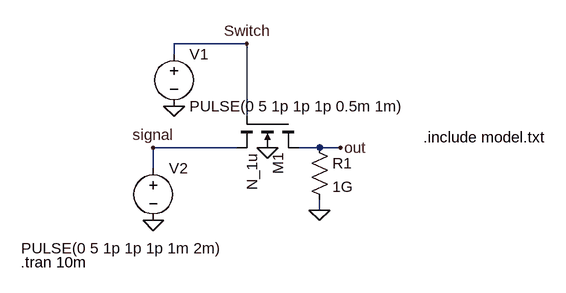
[diagram p0: schematic nmos_test_large_res.asc]
nmos_test_large_res.asc, the LTspice schematic file:
Version 4
SHEET 1 880 680
WIRE 176 16 64 16
WIRE 64 32 64 16
WIRE 176 128 176 16
WIRE 160 176 32 176
WIRE 288 176 256 176
WIRE 320 176 288 176
WIRE 32 208 32 176
WIRE 288 272 288 256
FLAG 208 176 0
FLAG 64 112 0
FLAG 32 288 0
FLAG 176 16 Switch
FLAG 32 176 signal
FLAG 320 176 out
FLAG 288 272 0
SYMBOL nmos4 256 128 R90
SYMATTR InstName M1
SYMATTR Value N_1u
SYMATTR Value2 l=0.9u w=1.8u
SYMBOL voltage 64 16 R0
WINDOW 123 0 0 Left 0
WINDOW 39 0 0 Left 0
SYMATTR InstName V1
SYMATTR Value PULSE(0 5 1p 1p 1p 0.5m 1m)
SYMBOL voltage 32 192 R0
WINDOW 3 -203 139 Left 2
WINDOW 123 0 0 Left 0
WINDOW 39 0 0 Left 0
SYMATTR InstName V2
SYMATTR Value PULSE(0 5 1p 1p 1p 1m 2m)
SYMBOL res 272 160 R0
SYMATTR InstName R1
SYMATTR Value 1G
TEXT -172 352 Left 2 !.tran 10m
TEXT 448 160 Left 2 !.include model.txt

The netlist it stands for:
* nmos_test_large_res.asc
M1 out Switch signal 0 N_1u l=0.9u w=1.8u
V1 Switch 0 PULSE(0 5 1p 1p 1p 0.5m 1m)
V2 signal 0 PULSE(0 5 1p 1p 1p 1m 2m)
R1 out 0 1G
.model NMOS NMOS
.model PMOS PMOS
.lib standard.mos
.tran 10m
.include model.txt
.backanno
.end